# Altium project MotorBoard.PrjPcb (part 2 of 2)

## Sheet 3V3_buck.SchDoc
size B; SheetNumber: 6; SheetTotal: 6
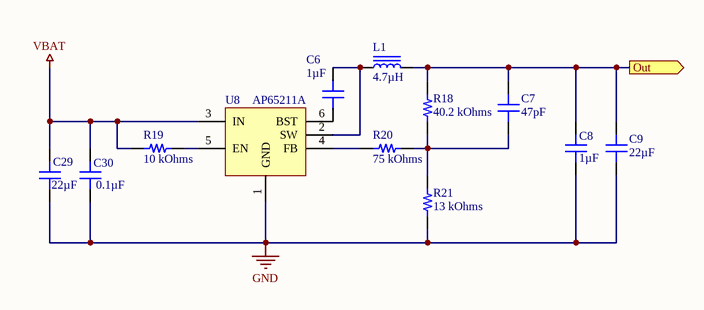
[diagram p5: 3V3_buck.SchDoc]

### Parts
C6  1µF  [CAP 0603_1608]
C7  47pF  [CAP 0603_1608]
C8  1µF  [CAP 0603_1608]
C9  22µF  [CAP 0805_2012]
C29  22µF  [CAP 0805_2012]
C30  0.1µF  [CAP 0603_1608]
L1  4.7µH  [IND 1008_2520]
R18  40.2 kOhms  [RES 0603_1608]
R19  10 kOhms  [RES 0603_1608]
R20  75 kOhms  [RES 0603_1608]
R21  13 kOhms  [RES 0603_1608]
U8  AP65211A  [TSOT-26-6]

### Ports
Out (out)

### Nets
3V3: C7.2 C8.2 C9.2 L1.2 R18.2 ; port Out
GND: C8.1 C9.1 C29.1 C30.2 R21.1 U8.1(GND)
VBAT: C29.2 C30.1 R19.2 U8.3(IN)
NetC6_1: C6.1 L1.1 U8.2(SW)
NetC6_2: C6.2 U8.6(BST)
NetC7_1: C7.1 R18.1 R20.2 R21.2
NetR19_1: R19.1 U8.5(EN)
NetR20_1: R20.1 U8.4(FB)

### Library data of the parts
C6 C8 = GCJ188R71E105KA01D: CAP CER 1UF 25V X7R 0603; Manufacturer: Murata Electronics; Tolerance: ±10%; Part Number: GCJ188R71E105KA01D; Value: 1µF; Applications: Automotive, Boardflex Sensitive; Capacitance: 1µF; ComponentLink1Description: Datasheet; ComponentLink1URL: https://search.murata.co.jp/Ceramy/image/img/A01X/G101/ENG/GCJ188R71E105KA01-01.pdf; ComponentLink2Description: DigiKey Link; ComponentLink2URL: http://digikey.com/product-detail/en/murata-electronics/GCJ188R71E105KA01D/490-14409-1-ND/6606870; Device Package: 0603 (1608 Metric); Features: Soft Termination; LastUpdated: 13-Aug-20 10:24:06 AM; Lifecycle Status: Active; Minimum Order: 1; Mounting Type: Surface Mount, MLCC; Operating Temperature: -55°C ~ 125°C; Package / Case: 0603 (1608 Metric); Packaging: TapeAndReel; PartId: 9566; Part Status: Active; Price: 0.05; Ratings: AEC-Q200; Series: GCJ; Size / Dimension: 0.063" L x 0.031" W (1.60mm x 0.80mm); Supplier 1: DigiKey; Supplier Part Number 1: 490-14409-1-ND; Temperature Coefficient: X7R; Thickness (Max): 0.035" (0.90mm)
C7 = C1608NP02A470J080AA: CAP CER 47PF 100V NP0 0603; Manufacturer: TDK Corporation; Temperature Coefficient: C0G, NP0; Tolerance: ±5%; Part Number: C1608NP02A470J080AA; Value: 47pF; Applications: General Purpose; Capacitance: 47pF; ComponentLink1Description: Datasheet; ComponentLink1URL: https://product.tdk.com/info/en/catalog/datasheets/mlcc_commercial_hightemp_en.pdf?ref_disty=digikey; ComponentLink2Description: DigiKey Link; ComponentLink2URL: http://digikey.com/product-detail/en/tdk-corporation/C1608NP02A470J080AA/445-14125-1-ND/3955791; Device Package: 0603 (1608 Metric); Features: High Temperature; LastUpdated: 13-Aug-20 10:25:18 AM; Lifecycle Status: Active; Minimum Order: 1; Mounting Type: Surface Mount, MLCC; Operating Temperature: -55°C ~ 150°C; Package / Case: 0603 (1608 Metric); Packaging: TapeAndReel; PartId: 7049; Part Status: Active; Price: 0.04; Series: C; Size / Dimension: 0.063" L x 0.031" W (1.60mm x 0.80mm); Supplier 1: DigiKey; Supplier Part Number 1: 445-14125-1-ND; Thickness (Max): 0.035" (0.90mm)
C9 = CL21A226MOQNNNE: CAP CER 22UF 16V X5R 0805; Manufacturer: Samsung Electro-Mechanics; Tolerance: ±20%; Part Number: CL21A226MOQNNNE; Value: 22µF; Applications: General Purpose; Capacitance: 22µF; ComponentLink1Description: Datasheet; ComponentLink1URL: http://www.samsungsem.com/kr/support/product-search/mlcc/CL21A226MOQNNNE.jsp; ComponentLink2Description: DigiKey Link; ComponentLink2URL: http://digikey.com/product-detail/en/samsung-electro-mechanics/CL21A226MOQNNNE/1276-2909-1-ND/3890995; Device Package: 0805 (2012 Metric); LastUpdated: 21-Jan-20 12:03:05 AM; Lifecycle Status: Active; Minimum Order: 1; Mounting Type: Surface Mount, MLCC; Operating Temperature: -55°C ~ 85°C; Package / Case: 0805 (2012 Metric); Packaging: TapeAndReel; PartId: 3052; Part Status: Active; Price: 0.11; Series: CL; Size / Dimension: 0.079" L x 0.049" W (2.00mm x 1.25mm); Supplier 1: DigiKey; Supplier Part Number 1: 1276-2909-1-ND; Temperature Coefficient: X5R; Thickness (Max): 0.055" (1.40mm); Voltage - Rated: 16V
C29 = C2012X7S1E106K125AC: CAP CER 10UF 25V X7S 0805; Manufacturer: TDK Corporation; Capacitance: 10µF; Tolerance: ±10%; Part Number: C2012X7S1E106K125AC; Value: 22µF; Applications: General Purpose; ComponentLink1Description: Datasheet; ComponentLink1URL: https://product.tdk.com/en/search/capacitor/ceramic/mlcc/info?part_no=C2012X7S1E106K125AC?ref_disty=digikey; ComponentLink2Description: DigiKey Link; ComponentLink2URL: http://digikey.com/product-detail/en/tdk-corporation/C2012X7S1E106K125AC/445-181600-1-ND/9991478; Device Package: 0805 (2012 Metric); Features: Low ESL; LastUpdated: 21-Jan-20 12:03:04 AM; Lifecycle Status: Active; Minimum Order: 1; Mounting Type: Surface Mount, MLCC; Operating Temperature: -55°C ~ 125°C; Package / Case: 0805 (2012 Metric); Packaging: TapeAndReel; PartId: 3339; Part Status: Active; Price: 0.15; Series: C; Size / Dimension: 0.079" L x 0.049" W (2.00mm x 1.25mm); Supplier 1: DigiKey; Supplier Part Number 1: 445-181600-1-ND; Temperature Coefficient: X7S; Thickness (Max): 0.057" (1.45mm); Voltage - Rated: 25V
C30 = GCG188R92A104KA03D: CAP CER 0.1UF 100V 0603 EPOXY; Manufacturer: Murata Electronics; Temperature Coefficient: X8R; Tolerance: ±10%; Part Number: GCG188R92A104KA03D; Value: 0.1µF; Applications: Automotive; Capacitance: 0.1µF; ComponentLink1Description: Datasheet; ComponentLink1URL: https://search.murata.co.jp/Ceramy/image/img/A01X/G101/ENG/GCG188R92A104KA03-01.pdf; ComponentLink2Description: DigiKey Link; ComponentLink2URL: http://digikey.com/product-detail/en/murata-electronics/GCG188R92A104KA03D/490-18197-1-ND/9867926; Device Package: 0603 (1608 Metric); Features: Epoxy Mountable; LastUpdated: 21-Jan-20 12:01:59 AM; Lifecycle Status: Active; Minimum Order: 1; Mounting Type: Surface Mount, MLCC, Epoxy; Operating Temperature: -55°C ~ 150°C; Package / Case: 0603 (1608 Metric); Packaging: TapeAndReel; PartId: 9025; Part Status: Active; Price: 0.07; Ratings: AEC-Q200; Series: GCG; Size / Dimension: 0.063" L x 0.031" W (1.60mm x 0.80mm); Supplier 1: DigiKey; Supplier Part Number 1: 490-18197-1-ND; Thickness (Max): 0.035" (0.90mm); Voltage - Rated: 100V
L1 = MLP2520S4R7ST0S1: FIXED IND 4.7UH 1A 110 MOHM SMD; Manufacturer: TDK Corporation; DC Resistance (DCR): 143mOhm Max; Inductance Frequency - Test: 2MHz; Material - Core: Ferrite; Shielding: Shielded; Tolerance: ±20%; Type: Multilayer; Part Number: MLP2520S4R7ST0S1; ComponentLink1Description: Datasheet; ComponentLink1URL: https://product.tdk.com/info/en/catalog/datasheets/inductor_commercial_power_mlp2520_en.pdf?ref_disty=digikey; ComponentLink2Description: DigiKey Link; ComponentLink2URL: http://digikey.com/product-detail/en/tdk-corporation/MLP2520S4R7ST0S1/445-6378-1-ND/2465705; Current Rating (Amps): 1A; Device Package: 1008 (2520 Metric); Height - Seated (Max): 0.039" (1.00mm); Inductance: 4.7µH; LastUpdated: 13-Aug-20 11:03:40 AM; Lifecycle Status: Active; Minimum Order: 1; Mounting Type: Surface Mount; Operating Temperature: -40°C ~ 125°C; Package / Case: 1008 (2520 Metric); Packaging: TapeAndReel; PartId: 3467; Part Status: Active; Price: 0.14; Series: MLP; Size / Dimension: 0.098" L x 0.079" W (2.50mm x 2.00mm); Supplier 1: DigiKey; Supplier Part Number 1: 445-6378-1-ND; Supplier Device Package: 1008 (2520 Metric); Value: 4.7µH
R18 = RT0603DRD0740K2L: RES SMD 40.2KOHM 0.5% 1/10W 0603; Manufacturer: Yageo; Power (Watts): 0.1W, 1/10W; Temperature Coefficient: ±25ppm/°C; Part Number: RT0603DRD0740K2L; Value: 40.2 kOhms; ComponentLink1Description: Datasheet; ComponentLink1URL: https://www.yageo.com/upload/media/product/productsearch/datasheet/rchip/PYu-RT_1-to-0.01_RoHS_L_11.pdf; ComponentLink2Description: DigiKey Link; ComponentLink2URL: http://digikey.com/product-detail/en/yageo/RT0603DRD0740K2L/311-40.2KDCT-ND/1035817; Composition: Thin Film; Device Package: 0603 (1608 Metric); Height - Seated (Max): 0.022" (0.55mm); LastUpdated: 13-Aug-20 10:36:48 AM; Lifecycle Status: Active; Minimum Order: 1; Number of Terminations: 2; Operating Temperature: -55°C ~ 155°C; Package / Case: 0603 (1608 Metric); Packaging: TapeAndReel; PartId: 18076; Part Status: Active; Price: 0.02; Resistance: 40.2 kOhms; Series: RT; Size / Dimension: 0.063" L x 0.031" W (1.60mm x 0.80mm); Supplier 1: DigiKey; Supplier Part Number 1: 311-40.2KDCT-ND; Supplier Device Package: 0603; Tolerance: ±0.5%
R19 = RNCS0603BKE10K0: RES 10K OHM 0.1% 1/16W 0603; Manufacturer: Stackpole Electronics Inc; Power (Watts): 0.063W, 1/16W; Temperature Coefficient: ±25ppm/°C; Part Number: RNCS0603BKE10K0; Value: 10 kOhms; ComponentLink1Description: Datasheet; ComponentLink1URL: https://www.seielect.com/catalog/sei-rncs_rnch.pdf; ComponentLink2Description: DigiKey Link; ComponentLink2URL: http://digikey.com/product-detail/en/stackpole-electronics-inc/RNCS0603BKE10K0/RNCS0603BKE10K0CT-ND/1800113; Composition: Thin Film; Device Package: 0603 (1608 Metric); Features: Anti-Corrosive, Automotive AEC-Q200, Moisture Resistant; Height - Seated (Max): 0.022" (0.55mm); LastUpdated: 21-Jan-20 12:25:01 AM; Lifecycle Status: Active; Minimum Order: 1; Number of Terminations: 2; Operating Temperature: -55°C ~ 155°C; Package / Case: 0603 (1608 Metric); Packaging: TapeAndReel; PartId: 4838; Part Status: Active; Price: 0.08; Ratings: AEC-Q200; Resistance: 10 kOhms; Series: RNCS; Size / Dimension: 0.061" L x 0.031" W (1.55mm x 0.80mm); Supplier 1: DigiKey; Supplier Part Number 1: RNCS0603BKE10K0CT-ND; Supplier Device Package: 0603; Tolerance: ±0.1%
R20 = CR0603-JW-753ELF: RES SMD 75K OHM 5% 1/10W 0603; Manufacturer: Bourns Inc.; Power (Watts): 0.1W, 1/10W; Temperature Coefficient: ±200ppm/°C; Part Number: CR0603-JW-753ELF; Value: 75 kOhms; ComponentLink1Description: Datasheet; ComponentLink1URL: https://www.bourns.com/docs/Product-Datasheets/CHPREZTR.pdf; ComponentLink2Description: DigiKey Link; ComponentLink2URL: http://digikey.com/product-detail/en/bourns-inc/CR0603-JW-753ELF/CR0603-JW-753ELFCT-ND/4247893; Composition: Thick Film; Device Package: 0603 (1608 Metric); Features: Moisture Resistant; Height - Seated (Max): 0.022" (0.55mm); LastUpdated: 13-Aug-20 10:36:37 AM; Lifecycle Status: Active; Minimum Order: 1; Number of Terminations: 2; Operating Temperature: -55°C ~ 155°C; Package / Case: 0603 (1608 Metric); Packaging: CutTape; PartId: 23428; Part Status: Active; Price: 0.10; Resistance: 75 kOhms; Series: CR0603; Size / Dimension: 0.063" L x 0.031" W (1.60mm x 0.80mm); Supplier 1: DigiKey; Supplier Part Number 1: CR0603-JW-753ELFCT-ND; Supplier Device Package: 0603; Tolerance: ±5%
R21 = RG1608P-133-B-T5: RES SMD 13K OHM 0.1% 1/10W 0603; Manufacturer: Susumu; Power (Watts): 0.1W, 1/10W; Temperature Coefficient: ±25ppm/°C; Part Number: RG1608P-133-B-T5; Value: 13 kOhms; ComponentLink1Description: Datasheet; ComponentLink1URL: //media.digikey.com/pdf/Data%20Sheets/Susumu%20PDFs/RG_RM_RGH_Oct2012.pdf; ComponentLink2Description: DigiKey Link; ComponentLink2URL: http://digikey.com/product-detail/en/susumu/RG1608P-133-B-T5/RG16P13.0KBCT-ND/1240863; Composition: Thin Film; Device Package: 0603 (1608 Metric); Features: Anti-Sulfur, Automotive AEC-Q200; Height - Seated (Max): 0.020" (0.50mm); LastUpdated: 13-Aug-20 10:37:00 AM; Lifecycle Status: Active; Minimum Order: 1; Number of Terminations: 2; Operating Temperature: -55°C ~ 155°C; Package / Case: 0603 (1608 Metric); Packaging: TapeAndReel; PartId: 12110; Part Status: Active; Price: 0.06; Ratings: AEC-Q200; Resistance: 13 kOhms; Series: RG; Size / Dimension: 0.063" L x 0.031" W (1.60mm x 0.80mm); Supplier 1: DigiKey; Supplier Part Number 1: RG16P13.0KBCT-ND; Supplier Device Package: 0603; Tolerance: ±0.1%
U8 = AP65211A: ADJ step down Buck

## Nets that join several sheets
3V3: Top (9 pins), Hall_sensor (9 pins), PIC32MK (17 pins), Power (R10.1), 3V3_buck (5 pins)
GND: Top (13 pins), U_Half_bridge_drivers1 (6 pins), U_Half_bridge_drivers2 (6 pins), U_Half_bridge_drivers3 (6 pins), Hall_sensor (9 pins), PIC32MK (21 pins), Power (22 pins), 3V3_buck (6 pins)
VBAT: Top (C28.1 U7.1), U_Half_bridge_drivers1 (8 pins), U_Half_bridge_drivers2 (8 pins), U_Half_bridge_drivers3 (8 pins), Power (21 pins), 3V3_buck (C29.2 C30.1 R19.2 U8.3)
Bridge_Out1: Top (P1.1), U_Half_bridge_drivers1 (C2_1.1 D3_1.1 U1_1.5)
Bridge_Out2: Top (P2.1), U_Half_bridge_drivers2 (C2_2.1 D3_2.1 U1_2.5)
Bridge_Out3: Top (P3.1), U_Half_bridge_drivers3 (C2_3.1 D3_3.1 U1_3.5)
HALL_OUT1: Hall_sensor (C11.2 R24.2), PIC32MK (U6.44)
HALL_OUT2: Hall_sensor (C35.2 R25.2), PIC32MK (U6.43)
HALL_OUT3: Hall_sensor (C36.2 R26.2), PIC32MK (U6.46)
I_SENSE2: U_Half_bridge_drivers2 (Q2_2.1 Q2_2.2 Q2_2.3 R7_2.2), PIC32MK (R34.1 U6.49)
I_SENSE3: U_Half_bridge_drivers3 (Q2_3.1 Q2_3.2 Q2_3.3 R7_3.2), PIC32MK (R17.1 U6.16)
INT: Top (U5.12), PIC32MK (U6.30)
NetU6_53: Top (U7.6), PIC32MK (U6.53)
NetU6_54: Top (U7.5), PIC32MK (U6.54)
PWMH1: U_Half_bridge_drivers1 (U1_1.8), PIC32MK (U6.60)
PWMH2: U_Half_bridge_drivers2 (U1_2.8), PIC32MK (U6.62)
PWMH3: U_Half_bridge_drivers3 (U1_3.8), PIC32MK (U6.2)
PWML1: U_Half_bridge_drivers1 (U1_1.7), PIC32MK (U6.61)
PWML2: U_Half_bridge_drivers2 (U1_2.7), PIC32MK (U6.63)
PWML3: U_Half_bridge_drivers3 (U1_3.7), PIC32MK (U6.3)
SCL: Top (R23.1 U5.23), PIC32MK (P10.1 U6.29)
SDA: Top (R22.1 U5.24), PIC32MK (P10.2 U6.28)

## Assembly variants
Main: not fitted J5 P1 P2 P3 P6 P6 P7 P7 P8 P8 P9 P9 R14